# Altium schematic sheet Э3-11.SchDoc
size 594 x 420 mm; Address1: Address1; Address2: Address2; Address3: Address3; Address4: Address4; SheetNumber: 10; SheetTotal: 12; DocumentType: Схема электрическая принципиальная
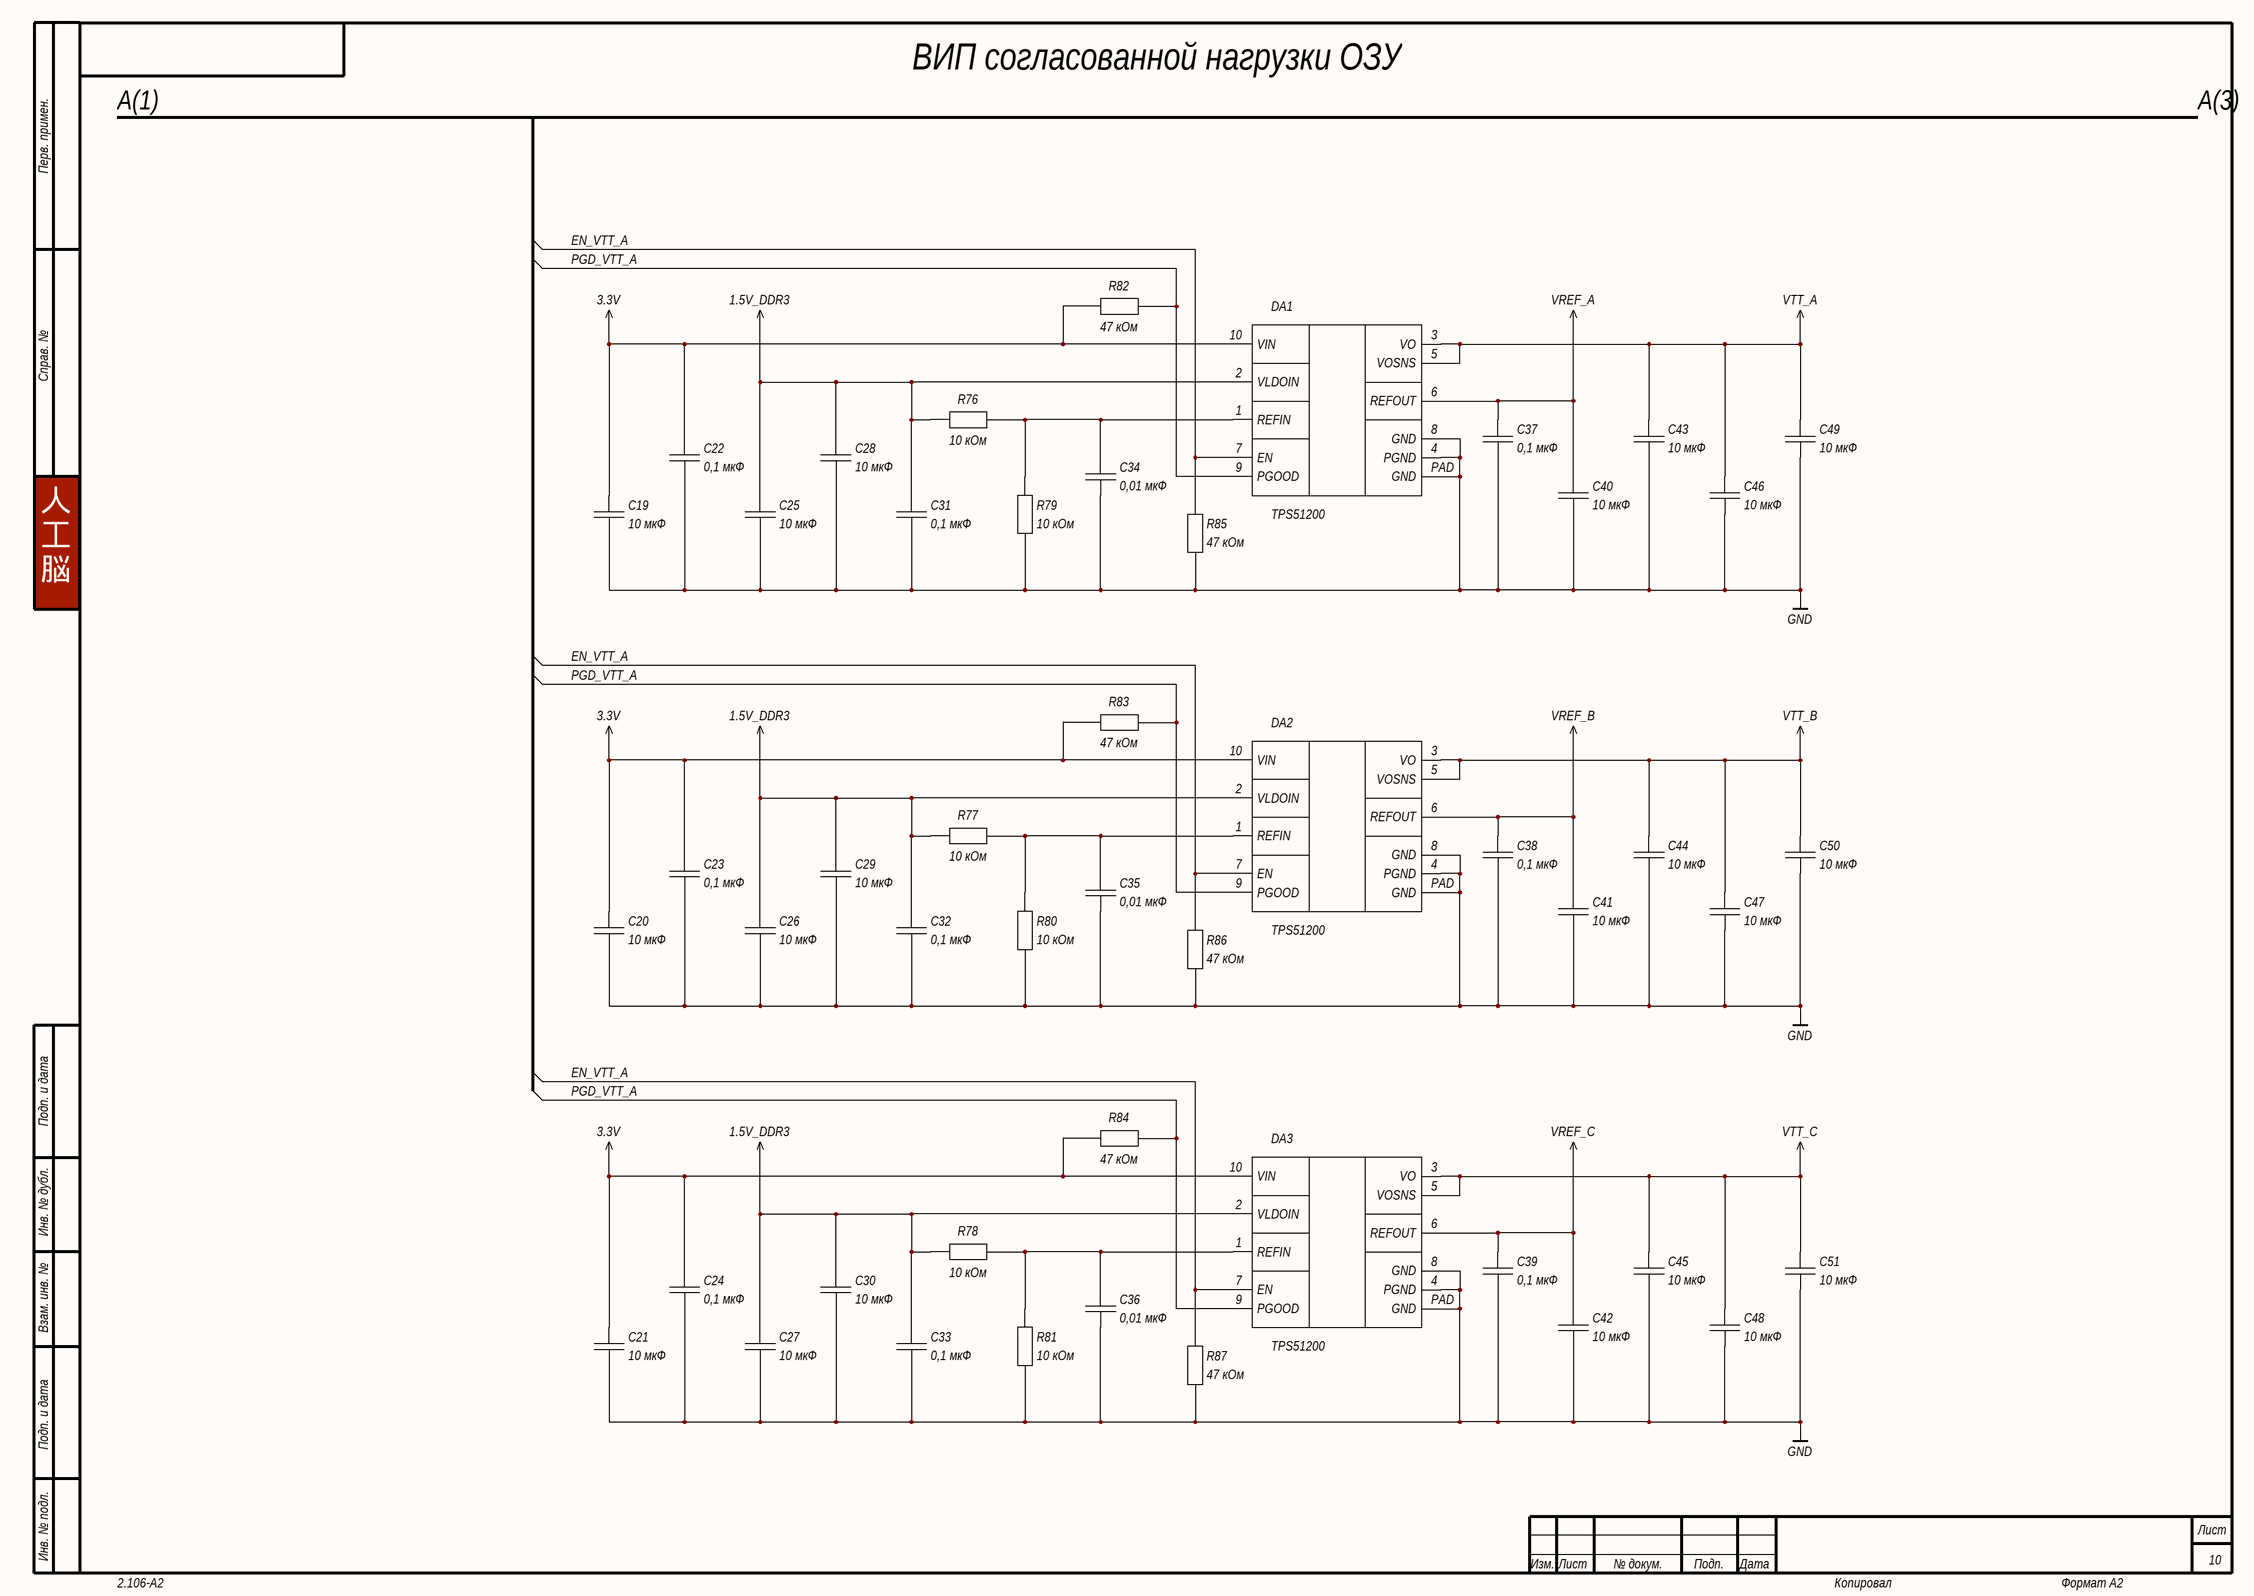
[diagram p0: Э3-11.SchDoc]

## Parts
C19  value 10 мкФ  [C0805-B-1.25mm-NO]  (hidden comment: 1)
C20  value 10 мкФ  [C0805-B-1.25mm-NO]  (hidden comment: 1)
C21  value 10 мкФ  [C0805-B-1.25mm-NO]  (hidden comment: 1)
C22  value 0,1 мкФ  [C0402-B-0.5mm-NO]  (hidden comment: 1)
C23  value 0,1 мкФ  [C0402-B-0.5mm-NO]  (hidden comment: 1)
C24  value 0,1 мкФ  [C0402-B-0.5mm-NO]  (hidden comment: 1)
C25  value 10 мкФ  [C0805-B-1.25mm-NO]  (hidden comment: 1)
C26  value 10 мкФ  [C0805-B-1.25mm-NO]  (hidden comment: 1)
C27  value 10 мкФ  [C0805-B-1.25mm-NO]  (hidden comment: 1)
C28  value 10 мкФ  [C0805-B-1.25mm-NO]  (hidden comment: 1)
C29  value 10 мкФ  [C0805-B-1.25mm-NO]  (hidden comment: 1)
C30  value 10 мкФ  [C0805-B-1.25mm-NO]  (hidden comment: 1)
C31  value 0,1 мкФ  [C0402-B-0.5mm-NO]  (hidden comment: 1)
C32  value 0,1 мкФ  [C0402-B-0.5mm-NO]  (hidden comment: 1)
C33  value 0,1 мкФ  [C0402-B-0.5mm-NO]  (hidden comment: 1)
C34  value 0,01 мкФ  [C0402-B-0.5mm-NO]  (hidden comment: 1)
C35  value 0,01 мкФ  [C0402-B-0.5mm-NO]  (hidden comment: 1)
C36  value 0,01 мкФ  [C0402-B-0.5mm-NO]  (hidden comment: 1)
C37  value 0,1 мкФ  [C0402-B-0.5mm-NO]  (hidden comment: 1)
C38  value 0,1 мкФ  [C0402-B-0.5mm-NO]  (hidden comment: 1)
C39  value 0,1 мкФ  [C0402-B-0.5mm-NO]  (hidden comment: 1)
C40  value 10 мкФ  [C0805-B-1.25mm-NO]  (hidden comment: 1)
C41  value 10 мкФ  [C0805-B-1.25mm-NO]  (hidden comment: 1)
C42  value 10 мкФ  [C0805-B-1.25mm-NO]  (hidden comment: 1)
C43  value 10 мкФ  [C0805-B-1.25mm-NO]  (hidden comment: 1)
C44  value 10 мкФ  [C0805-B-1.25mm-NO]  (hidden comment: 1)
C45  value 10 мкФ  [C0805-B-1.25mm-NO]  (hidden comment: 1)
C46  value 10 мкФ  [C0805-B-1.25mm-NO]  (hidden comment: 1)
C47  value 10 мкФ  [C0805-B-1.25mm-NO]  (hidden comment: 1)
C48  value 10 мкФ  [C0805-B-1.25mm-NO]  (hidden comment: 1)
C49  value 10 мкФ  [C0805-B-1.25mm-NO]  (hidden comment: 1)
C50  value 10 мкФ  [C0805-B-1.25mm-NO]  (hidden comment: 1)
C51  value 10 мкФ  [C0805-B-1.25mm-NO]  (hidden comment: 1)
DA1  1  (value not drawn)
DA2  1  (value not drawn)
DA3  1  (value not drawn)
R76  value 10 кОм  [CR0402-B-0.35mm-NO]  (hidden comment: 1)
R77  value 10 кОм  [CR0402-B-0.35mm-NO]  (hidden comment: 1)
R78  value 10 кОм  [CR0402-B-0.35mm-NO]  (hidden comment: 1)
R79  value 10 кОм  [CR0402-B-0.35mm-NO]  (hidden comment: 1)
R80  value 10 кОм  [CR0402-B-0.35mm-NO]  (hidden comment: 1)
R81  value 10 кОм  [CR0402-B-0.35mm-NO]  (hidden comment: 1)
R82  value 47 кОм  [CR0402-B-0.35mm-NO]  (hidden comment: 1)
R83  value 47 кОм  [CR0402-B-0.35mm-NO]  (hidden comment: 1)
R84  value 47 кОм  [CR0402-B-0.35mm-NO]  (hidden comment: 1)
R85  value 47 кОм  [CR0402-B-0.35mm-NO]  (hidden comment: 1)
R86  value 47 кОм  [CR0402-B-0.35mm-NO]  (hidden comment: 1)
R87  value 47 кОм  [CR0402-B-0.35mm-NO]  (hidden comment: 1)

## Nets
1.5V_DDR3: C25.1 C26.1 C27.1 C28.1 C29.1 C30.1 C31.1 C32.1 C33.1 DA1.2(VLDOIN) DA2.2(VLDOIN) DA3.2(VLDOIN) R76.1 R77.1 R78.1
3.3V: C19.1 C20.1 C21.1 C22.1 C23.1 C24.1 DA1.10(VIN) DA2.10(VIN) DA3.10(VIN) R82.1 R83.1 R84.1
GND: C19.2 C20.2 C21.2 C22.2 C23.2 C24.2 C25.2 C26.2 C27.2 C28.2 C29.2 C30.2 C31.2 C32.2 C33.2 C34.2 C35.2 C36.2 C37.2 C38.2 C39.2 C40.2 C41.2 C42.2 C43.2 C44.2 C45.2 C46.2 C47.2 C48.2 C49.2 C50.2 C51.2 DA1.4(PGND) DA1.8(GND) DA1.PAD(GND) DA2.4(PGND) DA2.8(GND) DA2.PAD(GND) DA3.4(PGND) DA3.8(GND) DA3.PAD(GND) R79.2 R80.2 R81.2 R85.2 R86.2 R87.2
VREF_A: C37.1 C40.1 DA1.6(REFOUT)
VREF_B: C38.1 C41.1 DA2.6(REFOUT)
VREF_C: C39.1 C42.1 DA3.6(REFOUT)
VTT_A: C43.1 C46.1 C49.1 DA1.3(VO) DA1.5(VOSNS)
VTT_B: C44.1 C47.1 C50.1 DA2.3(VO) DA2.5(VOSNS)
VTT_C: C45.1 C48.1 C51.1 DA3.3(VO) DA3.5(VOSNS)
EN_VTT_A: DA1.7(EN) DA2.7(EN) DA3.7(EN) R85.1 R86.1 R87.1
PGD_VTT_A: DA1.9(PGOOD) DA2.9(PGOOD) DA3.9(PGOOD) R82.2 R83.2 R84.2
NetC34_1: C34.1 DA1.1(REFIN) R76.2 R79.1
NetC35_1: C35.1 DA2.1(REFIN) R77.2 R80.1
NetC36_1: C36.1 DA3.1(REFIN) R78.2 R81.1

## Notes on the sheet
- A(1)
- ВИП согласованной нагрузки ОЗУ
- A(3)
- 人
  工
  脳
- Перв. примен.
- Справ. №
- Подп. и дата
- Инв. № дубл.
- Взам. инв. №
- Инв. № подл.
- Изм.
- Лист
- № докум.
- Подп.
- Дата
- 2.106-A2
- Копировал
- Формат А2

## Library data of the parts
C19-C21 C25-C30 C40-C51 = Non Polar Ver.: 0603 10 мкФ ±10% 10 В X5R; TemperatureRange: -...+°C; ComponentType: Конденсатор; Install: 1
C22-C24 C31-C33 C37-C39 = Non Polar Ver.: 0402 0,1 мкФ ±10% 25 В X7R; TemperatureRange: -...+°C; ComponentType: Конденсатор; Install: 1
C34-C36 = Non Polar Ver.: 0402 0,01 мкФ ±10% 25 В X7R; TemperatureRange: -...+°C; ComponentType: Конденсатор; Install: 1
DA1-DA3 = TPS51200: Sink and Source DDR Termination Regulator; Manufacturer: Texas Instruments, Inc.; TemperatureRange: -40...+85°C; ComponentType: Микросхема; Install: 1; PartNumber: TPS51200
R76-R78 = Resistor Hor.: 0402 10 кОм ±1%; TemperatureRange: -...+°C; ComponentType: Резистор; Install: 1
R79-R81 = Resistor Ver.: 0402 10 кОм ±1%; TemperatureRange: -...+°C; ComponentType: Резистор; Install: 1
R82-R84 = Resistor Hor.: 0402 47 кОм ±5%; TemperatureRange: -...+°C; ComponentType: Резистор; Install: 1
R85-R87 = Resistor Ver.: 0402 47 кОм ±5%; TemperatureRange: -...+°C; ComponentType: Резистор; Install: 1